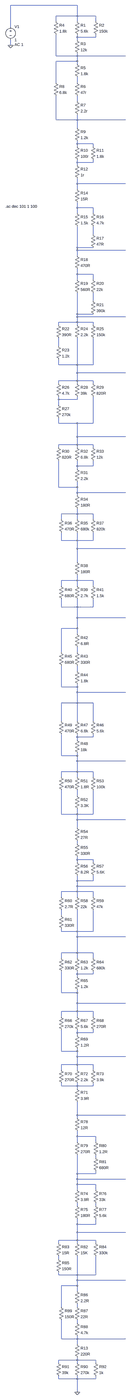
[diagram p0: schematic rotary switch.asc, whole sheet]
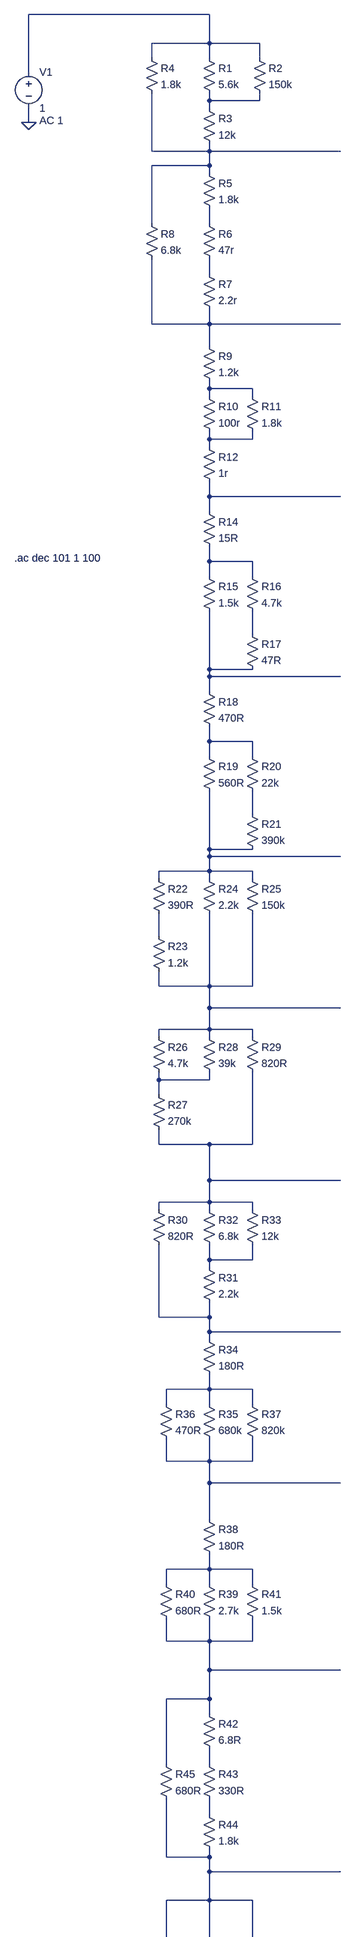
[diagram p1: schematic rotary switch.asc, part, row 1 of 2, column 1 of 1]
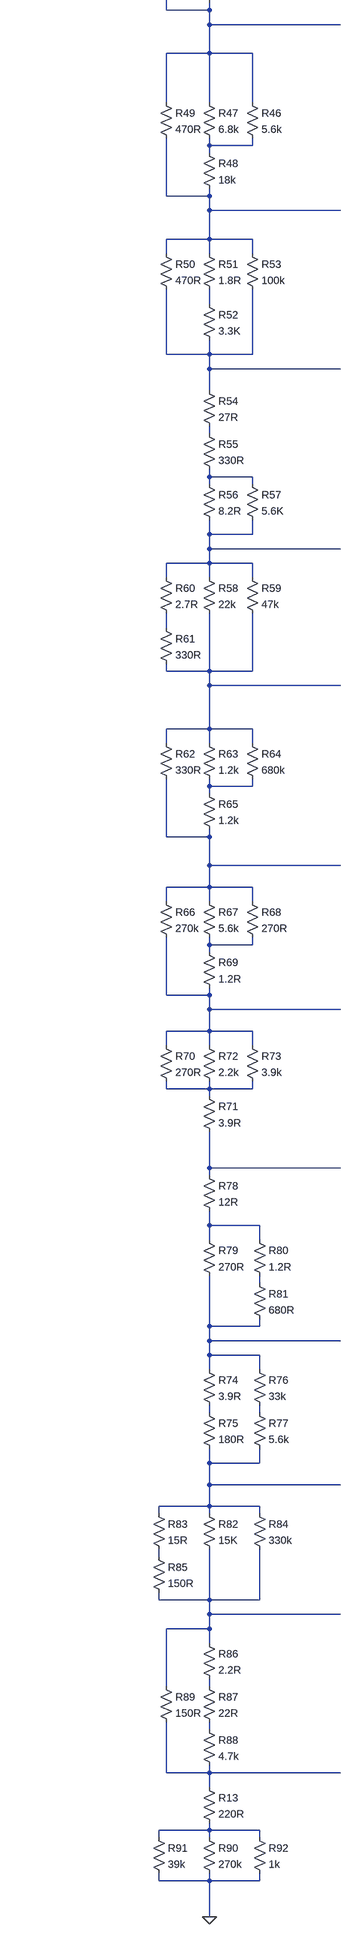
[diagram p2: schematic rotary switch.asc, part, row 2 of 2, column 1 of 1]
rotary switch.asc, the LTspice schematic file:
Version 4
SHEET 1 1156 8372
WIRE 144 -16 -288 -16
WIRE 144 48 144 -16
WIRE 144 48 16 48
WIRE 256 48 144 48
WIRE 16 80 16 48
WIRE 144 80 144 48
WIRE 256 80 256 48
WIRE -288 112 -288 -16
WIRE 144 176 144 160
WIRE 256 176 256 160
WIRE 256 176 144 176
WIRE 144 192 144 176
WIRE -288 224 -288 192
WIRE 16 288 16 160
WIRE 144 288 144 272
WIRE 144 288 16 288
WIRE 496 288 144 288
WIRE 144 320 144 288
WIRE 144 320 16 320
WIRE 144 336 144 320
WIRE 16 448 16 320
WIRE 144 448 144 416
WIRE 144 560 144 528
WIRE 16 672 16 528
WIRE 144 672 144 640
WIRE 144 672 16 672
WIRE 496 672 144 672
WIRE 144 720 144 672
WIRE 144 816 144 800
WIRE 240 816 144 816
WIRE 144 832 144 816
WIRE 240 832 240 816
WIRE 144 928 144 912
WIRE 240 928 240 912
WIRE 240 928 144 928
WIRE 144 944 144 928
WIRE 144 1056 144 1024
WIRE 496 1056 144 1056
WIRE 144 1088 144 1056
WIRE 144 1200 144 1168
WIRE 240 1200 144 1200
WIRE 144 1232 144 1200
WIRE 240 1232 240 1200
WIRE 240 1360 240 1312
WIRE 144 1440 144 1312
WIRE 240 1440 144 1440
WIRE 144 1456 144 1440
WIRE 496 1456 144 1456
WIRE 144 1488 144 1456
WIRE 144 1600 144 1568
WIRE 240 1600 144 1600
WIRE 144 1632 144 1600
WIRE 240 1632 240 1600
WIRE 240 1760 240 1712
WIRE 144 1840 144 1712
WIRE 240 1840 144 1840
WIRE 144 1856 144 1840
WIRE 496 1856 144 1856
WIRE 144 1888 144 1856
WIRE 144 1888 32 1888
WIRE 240 1888 144 1888
WIRE 32 1904 32 1888
WIRE 144 1904 144 1888
WIRE 240 1904 240 1888
WIRE 32 2032 32 1984
WIRE 32 2144 32 2112
WIRE 144 2144 144 1984
WIRE 144 2144 32 2144
WIRE 240 2144 240 1984
WIRE 240 2144 144 2144
WIRE 144 2192 144 2144
WIRE 496 2192 144 2192
WIRE 144 2240 144 2192
WIRE 144 2240 32 2240
WIRE 240 2240 144 2240
WIRE 32 2256 32 2240
WIRE 144 2256 144 2240
WIRE 240 2256 240 2240
WIRE 32 2352 32 2336
WIRE 144 2352 144 2336
WIRE 144 2352 32 2352
WIRE 32 2384 32 2352
WIRE 32 2496 32 2464
WIRE 144 2496 32 2496
WIRE 240 2496 240 2336
WIRE 240 2496 144 2496
WIRE 144 2576 144 2496
WIRE 496 2576 144 2576
WIRE 144 2624 144 2576
WIRE 144 2624 32 2624
WIRE 240 2624 144 2624
WIRE 32 2640 32 2624
WIRE 144 2640 144 2624
WIRE 240 2640 240 2624
WIRE 144 2752 144 2720
WIRE 240 2752 240 2720
WIRE 240 2752 144 2752
WIRE 144 2768 144 2752
WIRE 32 2880 32 2720
WIRE 144 2880 144 2848
WIRE 144 2880 32 2880
WIRE 144 2912 144 2880
WIRE 496 2912 144 2912
WIRE 144 2928 144 2912
WIRE 144 3040 144 3008
WIRE 144 3040 48 3040
WIRE 240 3040 144 3040
WIRE 48 3072 48 3040
WIRE 144 3072 144 3040
WIRE 240 3072 240 3040
WIRE 48 3200 48 3152
WIRE 144 3200 144 3152
WIRE 144 3200 48 3200
WIRE 240 3200 240 3152
WIRE 240 3200 144 3200
WIRE 144 3248 144 3200
WIRE 496 3248 144 3248
WIRE 144 3328 144 3248
WIRE 144 3440 144 3408
WIRE 144 3440 48 3440
WIRE 240 3440 144 3440
WIRE 48 3472 48 3440
WIRE 144 3472 144 3440
WIRE 240 3472 240 3440
WIRE 48 3600 48 3552
WIRE 144 3600 144 3552
WIRE 144 3600 48 3600
WIRE 240 3600 240 3552
WIRE 240 3600 144 3600
WIRE 144 3664 144 3600
WIRE 496 3664 144 3664
WIRE 144 3728 144 3664
WIRE 144 3728 48 3728
WIRE 144 3760 144 3728
WIRE 48 3872 48 3728
WIRE 144 3872 144 3840
WIRE 144 3984 144 3952
WIRE 48 4080 48 3952
WIRE 144 4080 144 4064
WIRE 144 4080 48 4080
WIRE 144 4112 144 4080
WIRE 496 4112 144 4112
WIRE 144 4176 144 4112
WIRE 144 4176 48 4176
WIRE 240 4176 144 4176
WIRE 48 4320 48 4176
WIRE 144 4320 144 4176
WIRE 240 4320 240 4176
WIRE 144 4416 144 4400
WIRE 240 4416 240 4400
WIRE 240 4416 144 4416
WIRE 144 4432 144 4416
WIRE 48 4528 48 4400
WIRE 144 4528 144 4512
WIRE 144 4528 48 4528
WIRE 144 4560 144 4528
WIRE 496 4560 144 4560
WIRE 144 4624 144 4560
WIRE 144 4624 48 4624
WIRE 240 4624 144 4624
WIRE 48 4656 48 4624
WIRE 144 4656 144 4624
WIRE 240 4656 240 4624
WIRE 144 4768 144 4736
WIRE 48 4880 48 4736
WIRE 144 4880 144 4848
WIRE 144 4880 48 4880
WIRE 240 4880 240 4736
WIRE 240 4880 144 4880
WIRE 144 4912 144 4880
WIRE 496 4912 144 4912
WIRE 144 4960 144 4912
WIRE 144 5056 144 5040
WIRE 144 5152 144 5136
WIRE 240 5152 144 5152
WIRE 144 5168 144 5152
WIRE 240 5168 240 5152
WIRE 144 5280 144 5248
WIRE 240 5280 240 5248
WIRE 240 5280 144 5280
WIRE 144 5312 144 5280
WIRE 496 5312 144 5312
WIRE 144 5344 144 5312
WIRE 144 5344 48 5344
WIRE 240 5344 144 5344
WIRE 48 5376 48 5344
WIRE 144 5376 144 5344
WIRE 240 5376 240 5344
WIRE 48 5488 48 5456
WIRE 48 5584 48 5568
WIRE 144 5584 144 5456
WIRE 144 5584 48 5584
WIRE 240 5584 240 5456
WIRE 240 5584 144 5584
WIRE 144 5616 144 5584
WIRE 496 5616 144 5616
WIRE 144 5712 144 5616
WIRE 144 5712 48 5712
WIRE 240 5712 144 5712
WIRE 48 5744 48 5712
WIRE 144 5744 144 5712
WIRE 240 5744 240 5712
WIRE 144 5840 144 5824
WIRE 240 5840 240 5824
WIRE 240 5840 144 5840
WIRE 144 5856 144 5840
WIRE 48 5952 48 5824
WIRE 144 5952 144 5936
WIRE 144 5952 48 5952
WIRE 144 6016 144 5952
WIRE 496 6016 144 6016
WIRE 144 6064 144 6016
WIRE 144 6064 48 6064
WIRE 240 6064 144 6064
WIRE 48 6096 48 6064
WIRE 144 6096 144 6064
WIRE 240 6096 240 6064
WIRE 144 6192 144 6176
WIRE 240 6192 240 6176
WIRE 240 6192 144 6192
WIRE 144 6208 144 6192
WIRE 48 6304 48 6176
WIRE 144 6304 144 6288
WIRE 144 6304 48 6304
WIRE 144 6336 144 6304
WIRE 496 6336 144 6336
WIRE 144 6384 144 6336
WIRE 144 6384 48 6384
WIRE 240 6384 144 6384
WIRE 48 6416 48 6384
WIRE 144 6416 144 6384
WIRE 240 6416 240 6384
WIRE 48 6512 48 6496
WIRE 144 6512 144 6496
WIRE 144 6512 48 6512
WIRE 240 6512 240 6496
WIRE 240 6512 144 6512
WIRE 144 6528 144 6512
WIRE 144 6688 144 6608
WIRE 496 6688 144 6688
WIRE 144 6704 144 6688
WIRE 144 6816 144 6784
WIRE 256 6816 144 6816
WIRE 144 6848 144 6816
WIRE 256 6848 256 6816
WIRE 256 6944 256 6928
WIRE 144 7040 144 6928
WIRE 256 7040 256 7024
WIRE 256 7040 144 7040
WIRE 144 7072 144 7040
WIRE 496 7072 144 7072
WIRE 144 7104 144 7072
WIRE 256 7104 144 7104
WIRE 144 7136 144 7104
WIRE 256 7136 256 7104
WIRE 144 7232 144 7216
WIRE 256 7232 256 7216
WIRE 144 7344 144 7312
WIRE 256 7344 256 7312
WIRE 256 7344 144 7344
WIRE 144 7392 144 7344
WIRE 496 7392 144 7392
WIRE 144 7440 144 7392
WIRE 144 7440 32 7440
WIRE 256 7440 144 7440
WIRE 32 7456 32 7440
WIRE 144 7456 144 7440
WIRE 256 7456 256 7440
WIRE 32 7552 32 7536
WIRE 32 7648 32 7632
WIRE 144 7648 144 7536
WIRE 144 7648 32 7648
WIRE 256 7648 256 7536
WIRE 256 7648 144 7648
WIRE 144 7680 144 7648
WIRE 496 7680 144 7680
WIRE 144 7712 144 7680
WIRE 144 7712 48 7712
WIRE 144 7744 144 7712
WIRE 48 7840 48 7712
WIRE 144 7840 144 7824
WIRE 144 7936 144 7920
WIRE 48 8032 48 7920
WIRE 144 8032 144 8016
WIRE 144 8032 48 8032
WIRE 496 8032 144 8032
WIRE 144 8064 144 8032
WIRE 144 8160 144 8144
WIRE 144 8160 32 8160
WIRE 256 8160 144 8160
WIRE 32 8176 32 8160
WIRE 144 8176 144 8160
WIRE 256 8176 256 8160
WIRE 32 8272 32 8256
WIRE 144 8272 144 8256
WIRE 144 8272 32 8272
WIRE 256 8272 256 8256
WIRE 256 8272 144 8272
WIRE 144 8352 144 8272
FLAG -288 224 0
FLAG 144 8352 0
SYMBOL res 128 64 R0
SYMATTR InstName R1
SYMATTR Value 5.6k
SYMBOL res 240 64 R0
SYMATTR InstName R2
SYMATTR Value 150k
SYMBOL res 128 176 R0
SYMATTR InstName R3
SYMATTR Value 12k
SYMBOL res 0 64 R0
SYMATTR InstName R4
SYMATTR Value 1.8k
SYMBOL voltage -288 96 R0
WINDOW 123 24 124 Left 2
WINDOW 39 0 0 Left 0
SYMATTR Value2 AC 1
SYMATTR InstName V1
SYMATTR Value 1
SYMBOL res 128 320 R0
SYMATTR InstName R5
SYMATTR Value 1.8k
SYMBOL res 128 432 R0
SYMATTR InstName R6
SYMATTR Value 47r
SYMBOL res 128 544 R0
SYMATTR InstName R7
SYMATTR Value 2.2r
SYMBOL res 0 432 R0
SYMATTR InstName R8
SYMATTR Value 6.8k
SYMBOL res 128 704 R0
SYMATTR InstName R9
SYMATTR Value 1.2k
SYMBOL res 128 816 R0
SYMATTR InstName R10
SYMATTR Value 100r
SYMBOL res 224 816 R0
SYMATTR InstName R11
SYMATTR Value 1.8k
SYMBOL res 128 928 R0
SYMATTR InstName R12
SYMATTR Value 1r
SYMBOL res 128 1072 R0
SYMATTR InstName R14
SYMATTR Value 15R
SYMBOL res 128 1216 R0
SYMATTR InstName R15
SYMATTR Value 1.5k
SYMBOL res 224 1216 R0
SYMATTR InstName R16
SYMATTR Value 4.7k
SYMBOL res 224 1344 R0
SYMATTR InstName R17
SYMATTR Value 47R
SYMBOL res 128 1472 R0
SYMATTR InstName R18
SYMATTR Value 470R
SYMBOL res 128 1616 R0
SYMATTR InstName R19
SYMATTR Value 560R
SYMBOL res 224 1616 R0
SYMATTR InstName R20
SYMATTR Value 22k
SYMBOL res 224 1744 R0
SYMATTR InstName R21
SYMATTR Value 390k
SYMBOL res 16 1888 R0
SYMATTR InstName R22
SYMATTR Value 390R
SYMBOL res 16 2016 R0
SYMATTR InstName R23
SYMATTR Value 1.2k
SYMBOL res 128 1888 R0
SYMATTR InstName R24
SYMATTR Value 2.2k
SYMBOL res 224 1888 R0
SYMATTR InstName R25
SYMATTR Value 150k
SYMBOL res 16 2240 R0
SYMATTR InstName R26
SYMATTR Value 4.7k
SYMBOL res 16 2368 R0
SYMATTR InstName R27
SYMATTR Value 270k
SYMBOL res 128 2240 R0
SYMATTR InstName R28
SYMATTR Value 39k
SYMBOL res 224 2240 R0
SYMATTR InstName R29
SYMATTR Value 820R
SYMBOL res 16 2624 R0
SYMATTR InstName R30
SYMATTR Value 820R
SYMBOL res 128 2752 R0
SYMATTR InstName R31
SYMATTR Value 2.2k
SYMBOL res 128 2624 R0
SYMATTR InstName R32
SYMATTR Value 6.8k
SYMBOL res 224 2624 R0
SYMATTR InstName R33
SYMATTR Value 12k
SYMBOL res 128 2912 R0
SYMATTR InstName R34
SYMATTR Value 180R
SYMBOL res 128 3056 R0
SYMATTR InstName R35
SYMATTR Value 680k
SYMBOL res 32 3056 R0
SYMATTR InstName R36
SYMATTR Value 470R
SYMBOL res 224 3056 R0
SYMATTR InstName R37
SYMATTR Value 820k
SYMBOL res 128 3312 R0
SYMATTR InstName R38
SYMATTR Value 180R
SYMBOL res 128 3456 R0
SYMATTR InstName R39
SYMATTR Value 2.7k
SYMBOL res 32 3456 R0
SYMATTR InstName R40
SYMATTR Value 680R
SYMBOL res 224 3456 R0
SYMATTR InstName R41
SYMATTR Value 1.5k
SYMBOL res 128 3744 R0
SYMATTR InstName R42
SYMATTR Value 6.8R
SYMBOL res 128 3856 R0
SYMATTR InstName R43
SYMATTR Value 330R
SYMBOL res 128 3968 R0
SYMATTR InstName R44
SYMATTR Value 1.8k
SYMBOL res 32 3856 R0
SYMATTR InstName R45
SYMATTR Value 680R
SYMBOL res 224 4304 R0
SYMATTR InstName R46
SYMATTR Value 5.6k
SYMBOL res 128 4304 R0
SYMATTR InstName R47
SYMATTR Value 6.8k
SYMBOL res 128 4416 R0
SYMATTR InstName R48
SYMATTR Value 18k
SYMBOL res 32 4304 R0
SYMATTR InstName R49
SYMATTR Value 470R
SYMBOL res 32 4640 R0
SYMATTR InstName R50
SYMATTR Value 470R
SYMBOL res 128 4640 R0
SYMATTR InstName R51
SYMATTR Value 1.8R
SYMBOL res 128 4752 R0
SYMATTR InstName R52
SYMATTR Value 3.3K
SYMBOL res 224 4640 R0
SYMATTR InstName R53
SYMATTR Value 100k
SYMBOL res 128 4944 R0
SYMATTR InstName R54
SYMATTR Value 27R
SYMBOL res 128 5040 R0
SYMATTR InstName R55
SYMATTR Value 330R
SYMBOL res 128 5152 R0
SYMATTR InstName R56
SYMATTR Value 8.2R
SYMBOL res 224 5152 R0
SYMATTR InstName R57
SYMATTR Value 5.6K
SYMBOL res 128 5360 R0
SYMATTR InstName R58
SYMATTR Value 22k
SYMBOL res 224 5360 R0
SYMATTR InstName R59
SYMATTR Value 47k
SYMBOL res 32 5360 R0
SYMATTR InstName R60
SYMATTR Value 2.7R
SYMBOL res 32 5472 R0
SYMATTR InstName R61
SYMATTR Value 330R
SYMBOL res 32 5728 R0
SYMATTR InstName R62
SYMATTR Value 330R
SYMBOL res 128 5728 R0
SYMATTR InstName R63
SYMATTR Value 1.2k
SYMBOL res 224 5728 R0
SYMATTR InstName R64
SYMATTR Value 680k
SYMBOL res 128 5840 R0
SYMATTR InstName R65
SYMATTR Value 1.2k
SYMBOL res 32 6080 R0
SYMATTR InstName R66
SYMATTR Value 270k
SYMBOL res 128 6080 R0
SYMATTR InstName R67
SYMATTR Value 5.6k
SYMBOL res 224 6080 R0
SYMATTR InstName R68
SYMATTR Value 270R
SYMBOL res 128 6192 R0
SYMATTR InstName R69
SYMATTR Value 1.2R
SYMBOL res 32 6400 R0
SYMATTR InstName R70
SYMATTR Value 270R
SYMBOL res 128 6512 R0
SYMATTR InstName R71
SYMATTR Value 3.9R
SYMBOL res 128 6400 R0
SYMATTR InstName R72
SYMATTR Value 2.2k
SYMBOL res 224 6400 R0
SYMATTR InstName R73
SYMATTR Value 3.9k
SYMBOL res 128 7120 R0
SYMATTR InstName R74
SYMATTR Value 3.9R
SYMBOL res 128 7216 R0
SYMATTR InstName R75
SYMATTR Value 180R
SYMBOL res 240 7120 R0
SYMATTR InstName R76
SYMATTR Value 33k
SYMBOL res 240 7216 R0
SYMATTR InstName R77
SYMATTR Value 5.6k
SYMBOL res 128 6688 R0
SYMATTR InstName R78
SYMATTR Value 12R
SYMBOL res 128 6832 R0
SYMATTR InstName R79
SYMATTR Value 270R
SYMBOL res 240 6832 R0
SYMATTR InstName R80
SYMATTR Value 1.2R
SYMBOL res 240 6928 R0
SYMATTR InstName R81
SYMATTR Value 680R
SYMBOL res 128 7440 R0
SYMATTR InstName R82
SYMATTR Value 15K
SYMBOL res 16 7440 R0
SYMATTR InstName R83
SYMATTR Value 15R
SYMBOL res 240 7440 R0
SYMATTR InstName R84
SYMATTR Value 330k
SYMBOL res 16 7536 R0
SYMATTR InstName R85
SYMATTR Value 150R
SYMBOL res 128 7728 R0
SYMATTR InstName R86
SYMATTR Value 2.2R
SYMBOL res 128 7824 R0
SYMATTR InstName R87
SYMATTR Value 22R
SYMBOL res 128 7920 R0
SYMATTR InstName R88
SYMATTR Value 4.7k
SYMBOL res 32 7824 R0
SYMATTR InstName R89
SYMATTR Value 150R
SYMBOL res 128 8048 R0
SYMATTR InstName R13
SYMATTR Value 220R
SYMBOL res 128 8160 R0
SYMATTR InstName R90
SYMATTR Value 270k
SYMBOL res 16 8160 R0
SYMATTR InstName R91
SYMATTR Value 39k
SYMBOL res 240 8160 R0
SYMATTR InstName R92
SYMATTR Value 1k
TEXT -320 1192 Left 2 !.ac dec 101 1 100

The netlist it stands for:
* rotary switch.asc
R1 N001 N002 5.6k
R2 N001 N002 150k
R3 N002 N003 12k
R4 N001 N003 1.8k
V1 N001 0 1 AC 1
R5 N003 N004 1.8k
R6 N004 N005 47r
R7 N005 N006 2.2r
R8 N003 N006 6.8k
R9 N006 N007 1.2k
R10 N007 N008 100r
R11 N007 N008 1.8k
R12 N008 N009 1r
R14 N009 N010 15R
R15 N010 N012 1.5k
R16 N010 N011 4.7k
R17 N011 N012 47R
R18 N012 N013 470R
R19 N013 N015 560R
R20 N013 N014 22k
R21 N014 N015 390k
R22 N015 N016 390R
R23 N016 N017 1.2k
R24 N015 N017 2.2k
R25 N015 N017 150k
R26 N017 N018 4.7k
R27 N018 N019 270k
R28 N017 N018 39k
R29 N017 N019 820R
R30 N019 N021 820R
R31 N020 N021 2.2k
R32 N019 N020 6.8k
R33 N019 N020 12k
R34 N021 N022 180R
R35 N022 N023 680k
R36 N022 N023 470R
R37 N022 N023 820k
R38 N023 N024 180R
R39 N024 N025 2.7k
R40 N024 N025 680R
R41 N024 N025 1.5k
R42 N025 N026 6.8R
R43 N026 N027 330R
R44 N027 N028 1.8k
R45 N025 N028 680R
R46 N028 N029 5.6k
R47 N028 N029 6.8k
R48 N029 N030 18k
R49 N028 N030 470R
R50 N030 N032 470R
R51 N030 N031 1.8R
R52 N031 N032 3.3K
R53 N030 N032 100k
R54 N032 N033 27R
R55 N033 N034 330R
R56 N034 N035 8.2R
R57 N034 N035 5.6K
R58 N035 N037 22k
R59 N035 N037 47k
R60 N035 N036 2.7R
R61 N036 N037 330R
R62 N037 N039 330R
R63 N037 N038 1.2k
R64 N037 N038 680k
R65 N038 N039 1.2k
R66 N039 N041 270k
R67 N039 N040 5.6k
R68 N039 N040 270R
R69 N040 N041 1.2R
R70 N041 N042 270R
R71 N042 N043 3.9R
R72 N041 N042 2.2k
R73 N041 N042 3.9k
R74 N046 N047 3.9R
R75 N047 N049 180R
R76 N046 N048 33k
R77 N048 N049 5.6k
R78 N043 N044 12R
R79 N044 N046 270R
R80 N044 N045 1.2R
R81 N045 N046 680R
R82 N049 N051 15K
R83 N049 N050 15R
R84 N049 N051 330k
R85 N050 N051 150R
R86 N051 N052 2.2R
R87 N052 N053 22R
R88 N053 N054 4.7k
R89 N051 N054 150R
R13 N054 N055 220R
R90 N055 0 270k
R91 N055 0 39k
R92 N055 0 1k
.ac dec 101 1 100
.backanno
.end